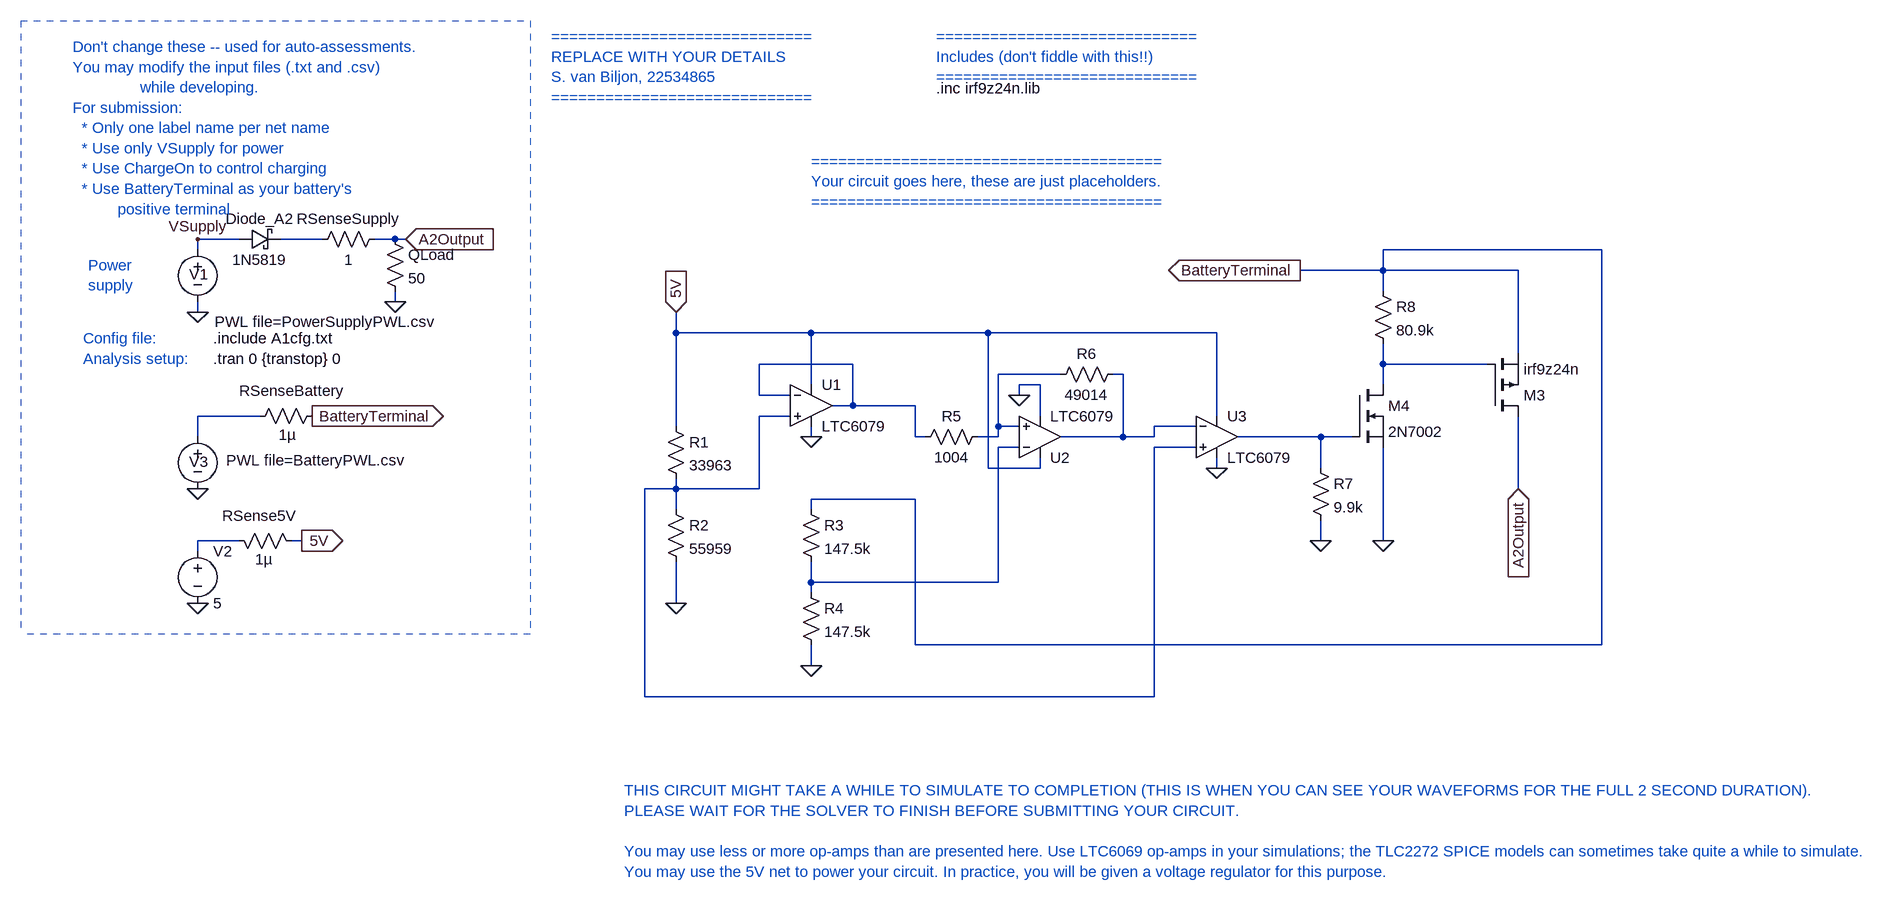
[diagram p0: schematic E344_22534865_A3.asc]
E344_22534865_A3.asc, the LTspice schematic file:
Version 4
SHEET 1 1824 680
WIRE -2032 -1088 -2096 -1088
WIRE -1904 -1088 -1968 -1088
WIRE -1792 -1088 -1824 -1088
WIRE -1776 -1088 -1792 -1088
WIRE -2096 -1072 -2096 -1088
WIRE 64 -1072 -272 -1072
WIRE -272 -1040 -272 -1072
WIRE -272 -1040 -400 -1040
WIRE -64 -1040 -272 -1040
WIRE -272 -1008 -272 -1040
WIRE -1792 -992 -1792 -1008
WIRE -2096 -976 -2096 -992
WIRE -1360 -944 -1360 -976
WIRE -1152 -944 -1360 -944
WIRE -880 -944 -1152 -944
WIRE -528 -944 -880 -944
WIRE -64 -912 -64 -1040
WIRE -1088 -896 -1232 -896
WIRE -272 -896 -272 -928
WIRE -112 -896 -272 -896
WIRE -768 -880 -864 -880
WIRE -672 -880 -688 -880
WIRE -1152 -864 -1152 -944
WIRE -800 -864 -832 -864
WIRE -272 -864 -272 -896
WIRE -1232 -848 -1232 -896
WIRE -1184 -848 -1232 -848
WIRE -832 -848 -832 -864
WIRE -1088 -832 -1088 -896
WIRE -1088 -832 -1120 -832
WIRE -992 -832 -1088 -832
WIRE -2000 -816 -2096 -816
WIRE -1184 -816 -1232 -816
WIRE -800 -816 -800 -864
WIRE -528 -816 -528 -944
WIRE -1360 -800 -1360 -944
WIRE -864 -800 -864 -880
WIRE -832 -800 -864 -800
WIRE -560 -800 -624 -800
WIRE -2096 -784 -2096 -816
WIRE -1152 -784 -1152 -800
WIRE -992 -784 -992 -832
WIRE -976 -784 -992 -784
WIRE -864 -784 -864 -800
WIRE -864 -784 -896 -784
WIRE -672 -784 -672 -880
WIRE -672 -784 -768 -784
WIRE -624 -784 -624 -800
WIRE -624 -784 -672 -784
WIRE -368 -784 -496 -784
WIRE -320 -784 -368 -784
WIRE -832 -768 -864 -768
WIRE -560 -768 -624 -768
WIRE -880 -736 -880 -944
WIRE -800 -736 -800 -752
WIRE -800 -736 -880 -736
WIRE -528 -736 -528 -752
WIRE -368 -736 -368 -784
WIRE -1360 -704 -1360 -720
WIRE -1360 -704 -1408 -704
WIRE -1232 -704 -1232 -816
WIRE -1232 -704 -1360 -704
WIRE -64 -704 -64 -816
WIRE -992 -688 -1152 -688
WIRE -1360 -672 -1360 -704
WIRE -1152 -672 -1152 -688
WIRE -2032 -624 -2096 -624
WIRE -1936 -624 -1952 -624
WIRE -368 -624 -368 -656
WIRE -272 -624 -272 -768
WIRE -2096 -608 -2096 -624
WIRE -1152 -560 -1152 -592
WIRE -864 -560 -864 -768
WIRE -864 -560 -1152 -560
WIRE -1152 -544 -1152 -560
WIRE -1360 -528 -1360 -592
WIRE -992 -464 -992 -688
WIRE 64 -464 64 -1072
WIRE 64 -464 -992 -464
WIRE -1152 -432 -1152 -464
WIRE -1408 -384 -1408 -704
WIRE -624 -384 -624 -768
WIRE -624 -384 -1408 -384
FLAG -2096 -976 0
FLAG -1776 -1088 A2Output
IOPIN -1776 -1088 In
FLAG -1920 -816 BatteryTerminal
IOPIN -1920 -816 Out
FLAG -2096 -704 0
FLAG -1936 -624 5V
IOPIN -1936 -624 Out
FLAG -2096 -1088 VSupply
FLAG -1792 -992 0
FLAG -2096 -528 0
FLAG -400 -1040 BatteryTerminal
IOPIN -400 -1040 Out
FLAG -64 -704 A2Output
IOPIN -64 -704 In
FLAG -1360 -976 5V
IOPIN -1360 -976 In
FLAG -1360 -528 0
FLAG -1152 -784 0
FLAG -832 -848 0
FLAG -1152 -432 0
FLAG -528 -736 0
FLAG -368 -624 0
FLAG -272 -624 0
SYMBOL voltage -2096 -1088 R0
WINDOW 123 0 0 Left 0
WINDOW 39 0 0 Left 0
WINDOW 3 26 127 Left 2
WINDOW 0 -13 54 Left 2
SYMATTR Value PWL file=PowerSupplyPWL.csv
SYMATTR InstName V1
SYMBOL res -1904 -832 R90
WINDOW 0 -7 47 VBottom 2
WINDOW 3 29 54 VTop 2
SYMATTR InstName RSenseBattery
SYMATTR Value 1µ
SYMBOL schottky -2032 -1072 R270
WINDOW 0 32 32 VTop 2
WINDOW 3 0 32 VBottom 2
SYMATTR InstName Diode_A2
SYMATTR Value 1N5819
SYMATTR Description Diode
SYMATTR Type diode
SYMBOL voltage -2096 -800 R0
WINDOW 123 0 0 Left 0
WINDOW 39 0 0 Left 0
WINDOW 3 44 52 Left 2
WINDOW 0 -13 54 Left 2
SYMATTR Value PWL file=BatteryPWL.csv
SYMATTR InstName V3
SYMBOL res -1920 -1072 R270
WINDOW 0 32 56 VTop 2
WINDOW 3 0 56 VBottom 2
SYMATTR InstName RSenseSupply
SYMATTR Value 1
SYMBOL res -1808 -1104 R0
SYMATTR InstName QLoad
SYMATTR Value 50
SYMBOL voltage -2096 -624 R0
WINDOW 123 0 0 Left 0
WINDOW 39 0 0 Left 0
SYMATTR InstName V2
SYMATTR Value 5
SYMBOL res -2048 -640 M90
WINDOW 0 -7 47 VBottom 2
WINDOW 3 29 54 VTop 2
SYMATTR InstName RSense5V
SYMATTR Value 1µ
SYMBOL pmos -112 -816 M180
SYMATTR InstName M3
SYMATTR Value irf9z24n
SYMATTR Prefix X
SYMATTR SpiceModel irf9z24n
SYMBOL nmos -320 -864 R0
SYMATTR InstName M4
SYMATTR Value 2N7002
SYMBOL OpAmps\\LTC6079 -1152 -832 R0
SYMATTR InstName U1
SYMBOL OpAmps\\LTC6079 -800 -784 M180
SYMATTR InstName U2
SYMBOL OpAmps\\LTC6079 -528 -784 R0
SYMATTR InstName U3
SYMBOL res -1376 -816 R0
SYMATTR InstName R1
SYMATTR Value 33963
SYMBOL res -1376 -688 R0
SYMATTR InstName R2
SYMATTR Value 55959
SYMBOL res -1168 -688 R0
SYMATTR InstName R3
SYMATTR Value 147.5k
SYMBOL res -1168 -560 R0
SYMATTR InstName R4
SYMATTR Value 147.5k
SYMBOL res -880 -800 R90
WINDOW 0 0 56 VBottom 2
WINDOW 3 32 56 VTop 2
SYMATTR InstName R5
SYMATTR Value 1004
SYMBOL res -672 -896 R90
WINDOW 0 0 56 VBottom 2
WINDOW 3 32 56 VTop 2
SYMATTR InstName R6
SYMATTR Value 49014
SYMBOL res -384 -752 R0
SYMATTR InstName R7
SYMATTR Value 9.9k
SYMBOL res -288 -1024 R0
SYMATTR InstName R8
SYMATTR Value 80.9k
TEXT -2072 -904 Left 2 !.tran 0 {transtop} 0
TEXT -2072 -936 Left 2 !.include A1cfg.txt
TEXT -2288 -1384 Left 2 ;Don't change these -- used for auto-assessments.\nYou may modify the input files (.txt and .csv) \n               while developing.\nFor submission: \n  * Only one label name per net name\n  * Use only VSupply for power\n  * Use ChargeOn to control charging\n  * Use BatteryTerminal as your battery's \n          positive terminal
TEXT -2272 -936 Left 2 ;Config file:
TEXT -2272 -904 Left 2 ;Analysis setup:
TEXT -2264 -1048 Left 2 ;Power\nsupply
TEXT -1552 -1400 Left 2 ;=============================\nREPLACE WITH YOUR DETAILS\nS. van Biljon, 22534865\n=============================
TEXT -960 -1320 Left 2 !.inc irf9z24n.lib
TEXT -960 -1400 Left 2 ;=============================\nIncludes (don't fiddle with this!!)\n=============================
TEXT -1152 -1208 Left 2 ;=======================================\nYour circuit goes here, these are just placeholders.\n=======================================
TEXT -1440 -240 Left 2 ;THIS CIRCUIT MIGHT TAKE A WHILE TO SIMULATE TO COMPLETION (THIS IS WHEN YOU CAN SEE YOUR WAVEFORMS FOR THE FULL 2 SECOND DURATION).\nPLEASE WAIT FOR THE SOLVER TO FINISH BEFORE SUBMITTING YOUR CIRCUIT.\n \nYou may use less or more op-amps than are presented here. Use LTC6069 op-amps in your simulations; the TLC2272 SPICE models can sometimes take quite a while to simulate.\nYou may use the 5V net to power your circuit. In practice, you will be given a voltage regulator for this purpose.
LINE Normal -1584 -1424 -1584 -480 2
LINE Normal -2368 -1424 -1584 -1424 2
LINE Normal -1584 -480 -2368 -480 2
LINE Normal -1584 -496 -1584 -496 2
LINE Normal -2368 -1424 -2368 -480 2

The netlist it stands for:
* E344_22534865_A3.asc
V1 VSupply 0 PWL file=PowerSupplyPWL.csv
RSenseBattery BatteryTerminal N006 1µ
Diode_A2 VSupply N001 1N5819
V3 N006 0 PWL file=BatteryPWL.csv
RSenseSupply N001 A2Output 1
R§QLoad A2Output 0 50
V2 N010 0 5
RSense5V N010 5V 1µ
XM3 A2Output N003 BatteryTerminal irf9z24n irf9z24n  ; pins D G S
M4 N003 N008 0 0 2N7002
XU1 N007 N002 5V 0 N002 LTC6078  ; LTC6079, pins In+ In- V+ V- OUT
XU2 N004 N009 5V 0 N005 LTC6078  ; LTC6079, pins In+ In- V+ V- OUT
XU3 N007 N005 5V 0 N008 LTC6078  ; LTC6079, pins In+ In- V+ V- OUT
R1 5V N007 33963
R2 N007 0 55959
R3 BatteryTerminal N009 147.5k
R4 N009 0 147.5k
R5 N004 N002 1004
R6 N005 N004 49014
R7 N008 0 9.9k
R8 BatteryTerminal N003 80.9k
.model D D
.lib standard.dio
.model NMOS NMOS
.model PMOS PMOS
.lib standard.mos
.tran 0 {transtop} 0
.include A1cfg.txt
* Don't change these -- used for auto-assessments.
* You may modify the input files (.txt and .csv)
*                while developing.
* For submission:
*   * Only one label name per net name
*   * Use only VSupply for power
*   * Use ChargeOn to control charging
*   * Use BatteryTerminal as your battery's
*           positive terminal
* Config file:
* Analysis setup:
* Power
* supply
* =============================
* REPLACE WITH YOUR DETAILS
* S. van Biljon, 22534865
* =============================
.inc irf9z24n.lib
* =============================
* Includes (don't fiddle with this!!)
* =============================
* =======================================
* Your circuit goes here, these are just placeholders.
* =======================================
* THIS CIRCUIT MIGHT TAKE A WHILE TO SIMULATE TO COMPLETION (THIS IS WHEN YOU CAN SEE YOUR WAVEFORMS FOR THE FULL 2 SECOND DURATION).
* PLEASE WAIT FOR THE SOLVER TO FINISH BEFORE SUBMITTING YOUR CIRCUIT.
* You may use less or more op-amps than are presented here. Use LTC6069 op-amps in your simulations; the TLC2272 SPICE models can sometimes take quite a while to simulate.
* You may use the 5V net to power your circuit. In practice, you will be given a voltage regulator for this purpose.
.lib LTC5.lib
.backanno
.end